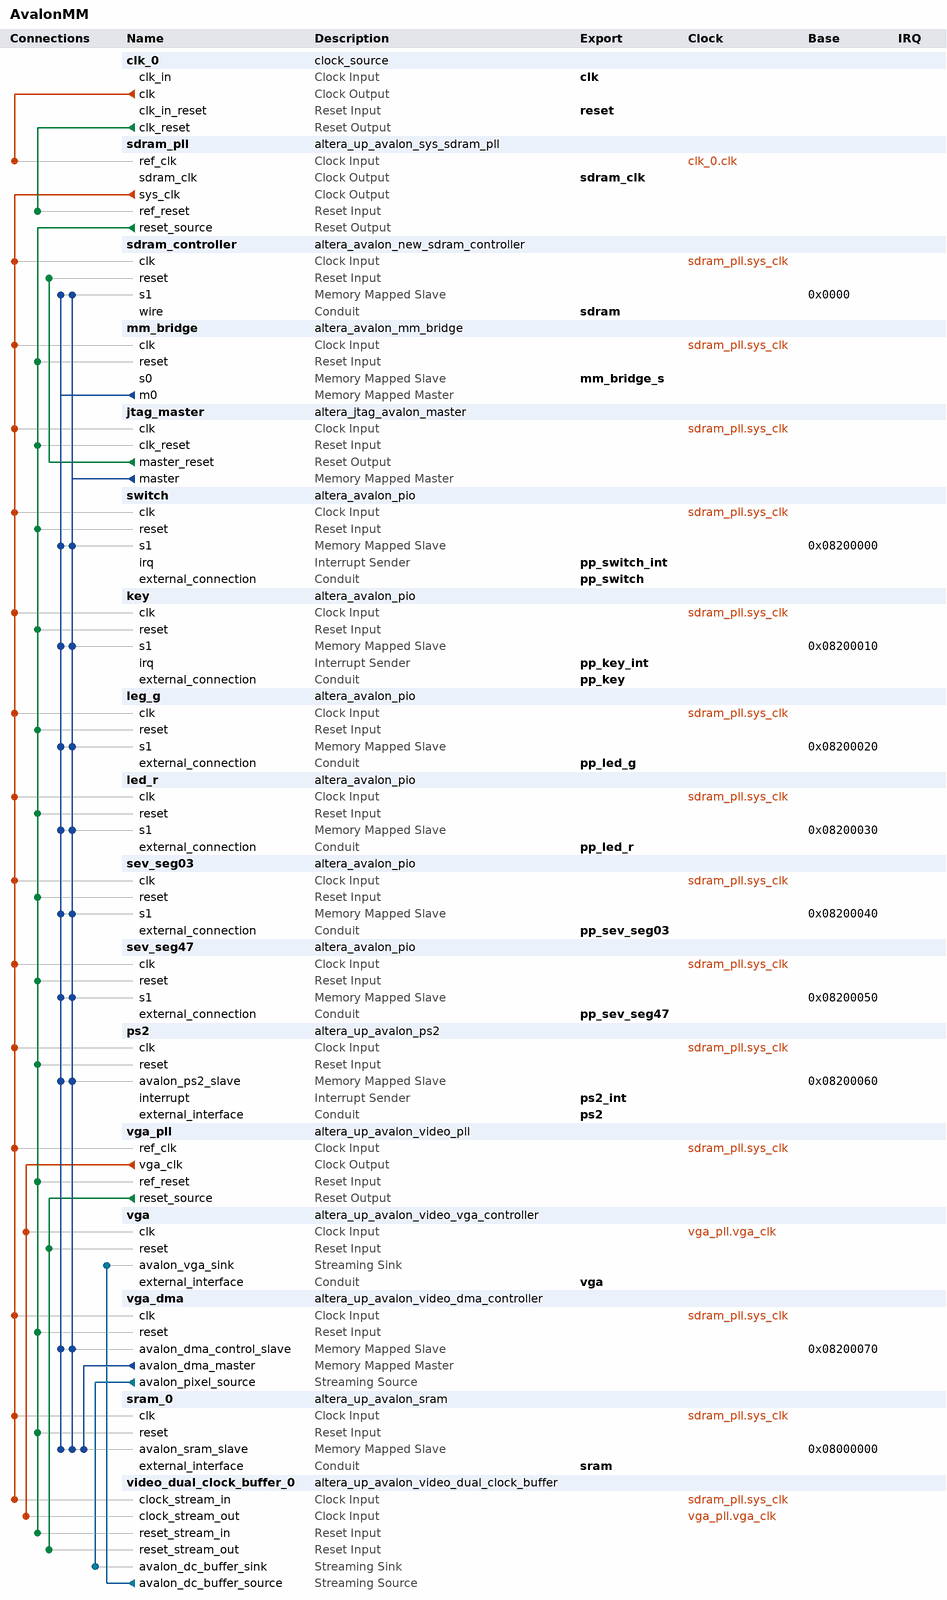
[diagram p0: system contents]
# Platform Designer (Qsys) system AvalonMM, Cyclone IV E EP4CE115F29C7
# Parameters at their usual value, and those the tool derives, are not listed.
package require -exact qsys 18.1
create_system AvalonMM
set_project_property DEVICE_FAMILY {Cyclone IV E}
set_project_property DEVICE EP4CE115F29C7

add_instance clk_0 clock_source 18.1
set_instance_parameter_value clk_0 clockFrequency 50000000

add_instance sdram_pll altera_up_avalon_sys_sdram_pll 18.0
set_instance_parameter_value sdram_pll CV_boards DE10-Standard
set_instance_parameter_value sdram_pll gui_outclk 50.0
set_instance_parameter_value sdram_pll gui_refclk 50.0

add_instance sdram_controller altera_avalon_new_sdram_controller 18.1
set_instance_parameter_value sdram_controller TAC 5.5
set_instance_parameter_value sdram_controller TRCD 20.0
set_instance_parameter_value sdram_controller TRP 20.0
set_instance_parameter_value sdram_controller casLatency 3
set_instance_parameter_value sdram_controller columnWidth 10
set_instance_parameter_value sdram_controller dataWidth 32
set_instance_parameter_value sdram_controller generateSimulationModel false
set_instance_parameter_value sdram_controller model single_Micron_MT48LC4M32B2_7_chip
set_instance_parameter_value sdram_controller numberOfBanks 4
set_instance_parameter_value sdram_controller numberOfChipSelects 1
set_instance_parameter_value sdram_controller powerUpDelay 200.0
set_instance_parameter_value sdram_controller refreshPeriod 7.8125
set_instance_parameter_value sdram_controller rowWidth 13

add_instance mm_bridge altera_avalon_mm_bridge 18.1
set_instance_parameter_value mm_bridge ADDRESS_UNITS SYMBOLS
set_instance_parameter_value mm_bridge ADDRESS_WIDTH 10
set_instance_parameter_value mm_bridge DATA_WIDTH 32
set_instance_parameter_value mm_bridge MAX_PENDING_RESPONSES 1
set_instance_parameter_value mm_bridge PIPELINE_COMMAND 0
set_instance_parameter_value mm_bridge PIPELINE_RESPONSE 0
set_instance_parameter_value mm_bridge USE_AUTO_ADDRESS_WIDTH 1

add_instance jtag_master altera_jtag_avalon_master 18.1

add_instance switch altera_avalon_pio 18.1
set_instance_parameter_value switch direction Input
set_instance_parameter_value switch generateIRQ true
set_instance_parameter_value switch width 18

add_instance key altera_avalon_pio 18.1
set_instance_parameter_value key captureEdge true
set_instance_parameter_value key direction Input
set_instance_parameter_value key edgeType ANY
set_instance_parameter_value key generateIRQ true
set_instance_parameter_value key irqType EDGE
set_instance_parameter_value key width 4

add_instance leg_g altera_avalon_pio 18.1
set_instance_parameter_value leg_g direction Output
set_instance_parameter_value leg_g width 9

add_instance led_r altera_avalon_pio 18.1
set_instance_parameter_value led_r direction Output
set_instance_parameter_value led_r width 18

add_instance sev_seg03 altera_avalon_pio 18.1
set_instance_parameter_value sev_seg03 direction Output
set_instance_parameter_value sev_seg03 width 32

add_instance sev_seg47 altera_avalon_pio 18.1
set_instance_parameter_value sev_seg47 direction Output
set_instance_parameter_value sev_seg47 width 32

add_instance ps2 altera_up_avalon_ps2 18.0

add_instance vga_pll altera_up_avalon_video_pll 18.0
set_instance_parameter_value vga_pll camera {5MP Digital Camera (THDB_D5M)}
set_instance_parameter_value vga_pll gui_refclk 50.0
set_instance_parameter_value vga_pll lcd {7" LCD on VEEK-MT and MTL/MTL2 Modules}

add_instance vga altera_up_avalon_video_vga_controller 18.0
set_instance_parameter_value vga board DE2-115
set_instance_parameter_value vga resolution {VGA 640x480}

add_instance vga_dma altera_up_avalon_video_dma_controller 18.0
set_instance_parameter_value vga_dma addr_mode X-Y
set_instance_parameter_value vga_dma back_start_address 0
set_instance_parameter_value vga_dma color_bits 10
set_instance_parameter_value vga_dma color_planes 3
set_instance_parameter_value vga_dma dma_enabled true
set_instance_parameter_value vga_dma height 480
set_instance_parameter_value vga_dma mode {From Memory to Stream}
set_instance_parameter_value vga_dma start_address 0
set_instance_parameter_value vga_dma width 640

add_instance sram_0 altera_up_avalon_sram 18.0
set_instance_parameter_value sram_0 board DE2-115
set_instance_parameter_value sram_0 pixel_buffer true

add_instance video_dual_clock_buffer_0 altera_up_avalon_video_dual_clock_buffer 18.0
set_instance_parameter_value video_dual_clock_buffer_0 color_bits 10

# connections
add_connection clk_0.clk sdram_pll.ref_clk clock
add_connection sdram_pll.sys_clk jtag_master.clk clock
add_connection sdram_pll.sys_clk key.clk clock
add_connection sdram_pll.sys_clk led_r.clk clock
add_connection sdram_pll.sys_clk leg_g.clk clock
add_connection sdram_pll.sys_clk mm_bridge.clk clock
add_connection sdram_pll.sys_clk ps2.clk clock
add_connection sdram_pll.sys_clk sdram_controller.clk clock
add_connection sdram_pll.sys_clk sev_seg03.clk clock
add_connection sdram_pll.sys_clk sev_seg47.clk clock
add_connection sdram_pll.sys_clk sram_0.clk clock
add_connection sdram_pll.sys_clk switch.clk clock
add_connection sdram_pll.sys_clk vga_dma.clk clock
add_connection sdram_pll.sys_clk vga_pll.ref_clk clock
add_connection sdram_pll.sys_clk video_dual_clock_buffer_0.clock_stream_in clock
add_connection vga_pll.vga_clk vga.clk clock
add_connection vga_pll.vga_clk video_dual_clock_buffer_0.clock_stream_out clock
add_connection clk_0.clk_reset sdram_pll.ref_reset reset
add_connection jtag_master.master_reset sdram_controller.reset reset
add_connection sdram_pll.reset_source jtag_master.clk_reset reset
add_connection sdram_pll.reset_source key.reset reset
add_connection sdram_pll.reset_source led_r.reset reset
add_connection sdram_pll.reset_source leg_g.reset reset
add_connection sdram_pll.reset_source mm_bridge.reset reset
add_connection sdram_pll.reset_source ps2.reset reset
add_connection sdram_pll.reset_source sev_seg03.reset reset
add_connection sdram_pll.reset_source sev_seg47.reset reset
add_connection sdram_pll.reset_source sram_0.reset reset
add_connection sdram_pll.reset_source switch.reset reset
add_connection sdram_pll.reset_source vga_dma.reset reset
add_connection sdram_pll.reset_source vga_pll.ref_reset reset
add_connection sdram_pll.reset_source video_dual_clock_buffer_0.reset_stream_in reset
add_connection vga_pll.reset_source vga.reset reset
add_connection vga_pll.reset_source video_dual_clock_buffer_0.reset_stream_out reset
add_connection jtag_master.master key.s1 avalon
set_connection_parameter_value jtag_master.master/key.s1 baseAddress 0x08200010
add_connection jtag_master.master led_r.s1 avalon
set_connection_parameter_value jtag_master.master/led_r.s1 baseAddress 0x08200030
add_connection jtag_master.master leg_g.s1 avalon
set_connection_parameter_value jtag_master.master/leg_g.s1 baseAddress 0x08200020
add_connection jtag_master.master ps2.avalon_ps2_slave avalon
set_connection_parameter_value jtag_master.master/ps2.avalon_ps2_slave baseAddress 0x08200060
add_connection jtag_master.master sdram_controller.s1 avalon
set_connection_parameter_value jtag_master.master/sdram_controller.s1 baseAddress 0x0000
add_connection jtag_master.master sev_seg03.s1 avalon
set_connection_parameter_value jtag_master.master/sev_seg03.s1 baseAddress 0x08200040
add_connection jtag_master.master sev_seg47.s1 avalon
set_connection_parameter_value jtag_master.master/sev_seg47.s1 baseAddress 0x08200050
add_connection jtag_master.master sram_0.avalon_sram_slave avalon
set_connection_parameter_value jtag_master.master/sram_0.avalon_sram_slave baseAddress 0x08000000
add_connection jtag_master.master switch.s1 avalon
set_connection_parameter_value jtag_master.master/switch.s1 baseAddress 0x08200000
add_connection jtag_master.master vga_dma.avalon_dma_control_slave avalon
set_connection_parameter_value jtag_master.master/vga_dma.avalon_dma_control_slave baseAddress 0x08200070
add_connection mm_bridge.m0 key.s1 avalon
set_connection_parameter_value mm_bridge.m0/key.s1 baseAddress 0x08200010
add_connection mm_bridge.m0 led_r.s1 avalon
set_connection_parameter_value mm_bridge.m0/led_r.s1 baseAddress 0x08200030
add_connection mm_bridge.m0 leg_g.s1 avalon
set_connection_parameter_value mm_bridge.m0/leg_g.s1 baseAddress 0x08200020
add_connection mm_bridge.m0 ps2.avalon_ps2_slave avalon
set_connection_parameter_value mm_bridge.m0/ps2.avalon_ps2_slave baseAddress 0x08200060
add_connection mm_bridge.m0 sdram_controller.s1 avalon
set_connection_parameter_value mm_bridge.m0/sdram_controller.s1 baseAddress 0x0000
add_connection mm_bridge.m0 sev_seg03.s1 avalon
set_connection_parameter_value mm_bridge.m0/sev_seg03.s1 baseAddress 0x08200040
add_connection mm_bridge.m0 sev_seg47.s1 avalon
set_connection_parameter_value mm_bridge.m0/sev_seg47.s1 baseAddress 0x08200050
add_connection mm_bridge.m0 sram_0.avalon_sram_slave avalon
set_connection_parameter_value mm_bridge.m0/sram_0.avalon_sram_slave baseAddress 0x08000000
add_connection mm_bridge.m0 switch.s1 avalon
set_connection_parameter_value mm_bridge.m0/switch.s1 baseAddress 0x08200000
add_connection mm_bridge.m0 vga_dma.avalon_dma_control_slave avalon
set_connection_parameter_value mm_bridge.m0/vga_dma.avalon_dma_control_slave baseAddress 0x08200070
add_connection vga_dma.avalon_dma_master sram_0.avalon_sram_slave avalon
set_connection_parameter_value vga_dma.avalon_dma_master/sram_0.avalon_sram_slave baseAddress 0x08000000
add_connection vga_dma.avalon_pixel_source video_dual_clock_buffer_0.avalon_dc_buffer_sink avalon_streaming
add_connection video_dual_clock_buffer_0.avalon_dc_buffer_source vga.avalon_vga_sink avalon_streaming

# exported interfaces
add_interface clk clock sink
set_interface_property clk EXPORT_OF clk_0.clk_in
add_interface mm_bridge_s avalon slave
set_interface_property mm_bridge_s EXPORT_OF mm_bridge.s0
add_interface pp_key conduit end
set_interface_property pp_key EXPORT_OF key.external_connection
add_interface pp_key_int interrupt sender
set_interface_property pp_key_int EXPORT_OF key.irq
add_interface pp_led_g conduit end
set_interface_property pp_led_g EXPORT_OF leg_g.external_connection
add_interface pp_led_r conduit end
set_interface_property pp_led_r EXPORT_OF led_r.external_connection
add_interface pp_sev_seg03 conduit end
set_interface_property pp_sev_seg03 EXPORT_OF sev_seg03.external_connection
add_interface pp_sev_seg47 conduit end
set_interface_property pp_sev_seg47 EXPORT_OF sev_seg47.external_connection
add_interface pp_switch conduit end
set_interface_property pp_switch EXPORT_OF switch.external_connection
add_interface pp_switch_int interrupt sender
set_interface_property pp_switch_int EXPORT_OF switch.irq
add_interface ps2 conduit end
set_interface_property ps2 EXPORT_OF ps2.external_interface
add_interface ps2_int interrupt sender
set_interface_property ps2_int EXPORT_OF ps2.interrupt
add_interface reset reset sink
set_interface_property reset EXPORT_OF clk_0.clk_in_reset
add_interface sdram conduit end
set_interface_property sdram EXPORT_OF sdram_controller.wire
add_interface sdram_clk clock source
set_interface_property sdram_clk EXPORT_OF sdram_pll.sdram_clk
add_interface sram conduit end
set_interface_property sram EXPORT_OF sram_0.external_interface
add_interface vga conduit end
set_interface_property vga EXPORT_OF vga.external_interface

set_interconnect_requirement {$system} qsys_mm.clockCrossingAdapter HANDSHAKE
set_interconnect_requirement {$system} qsys_mm.enableEccProtection FALSE
set_interconnect_requirement {$system} qsys_mm.insertDefaultSlave FALSE
set_interconnect_requirement {$system} qsys_mm.maxAdditionalLatency 1

save_system AvalonMM.qsys
